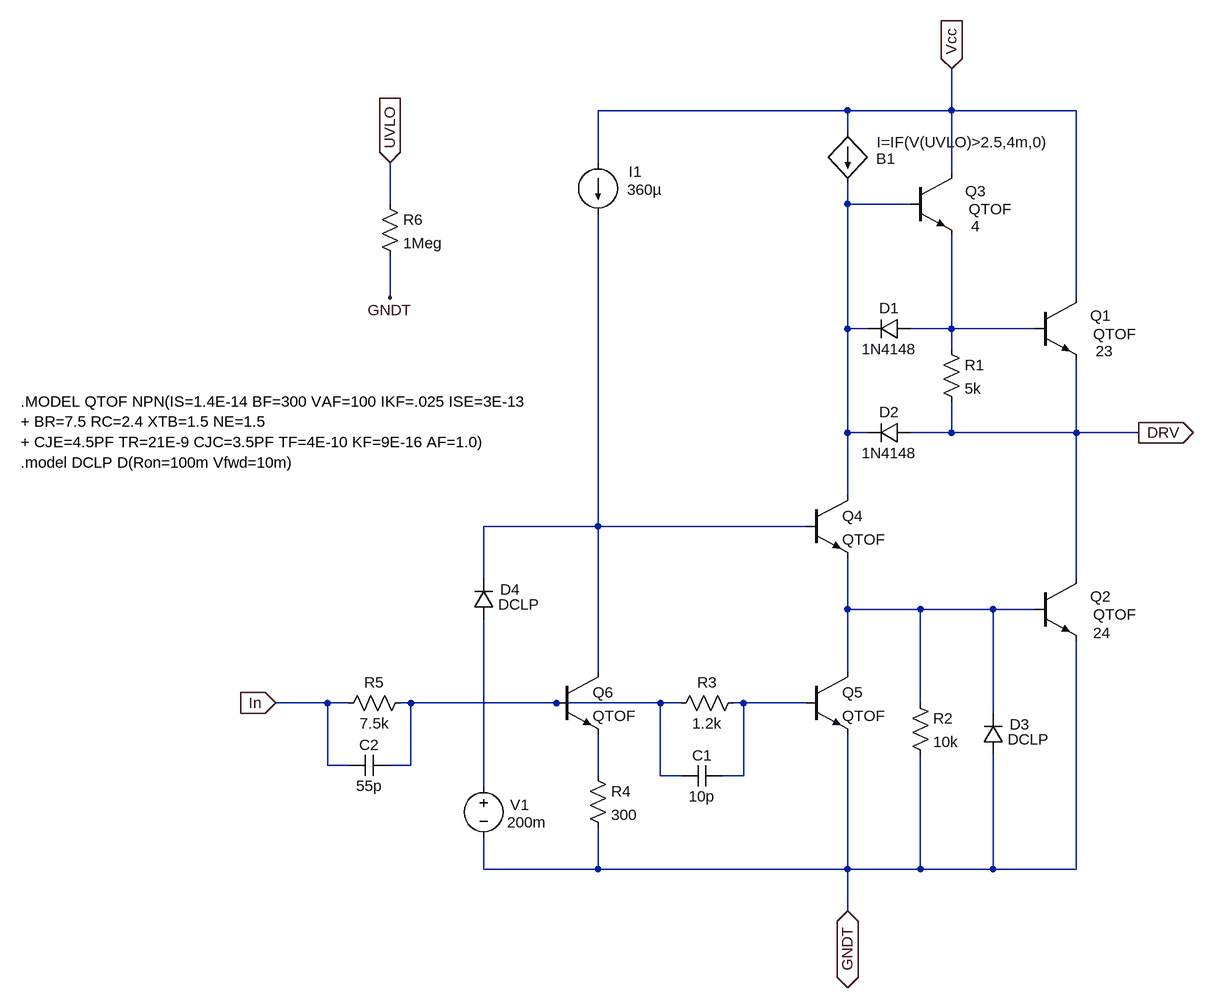
[diagram p0: schematic DRV_384x.asc]
DRV_384x.asc, the LTspice schematic file:
Version 4.1
SHEET 1 1560 1148
WIRE -112 -208 -496 -208
WIRE 48 -208 48 -272
WIRE 48 -208 -112 -208
WIRE 240 -208 48 -208
WIRE -112 -176 -112 -208
WIRE -496 -128 -496 -208
WIRE 48 -112 48 -208
WIRE -816 -64 -816 -128
WIRE -112 -64 -112 -96
WIRE -16 -64 -112 -64
WIRE -816 80 -816 16
WIRE 240 80 240 -208
WIRE -112 128 -112 -64
WIRE -80 128 -112 128
WIRE 48 128 48 -16
WIRE 48 128 -16 128
WIRE 176 128 48 128
WIRE 48 160 48 128
WIRE -112 288 -112 128
WIRE -80 288 -112 288
WIRE 48 288 48 240
WIRE 48 288 -16 288
WIRE 240 288 240 176
WIRE 240 288 48 288
WIRE 336 288 240 288
WIRE -112 384 -112 288
WIRE -496 432 -496 -48
WIRE -496 432 -672 432
WIRE -176 432 -496 432
WIRE -672 512 -672 432
WIRE 240 512 240 288
WIRE -112 560 -112 480
WIRE 0 560 -112 560
WIRE 112 560 0 560
WIRE 176 560 112 560
WIRE -496 656 -496 432
WIRE -112 656 -112 560
WIRE -912 704 -992 704
WIRE -880 704 -912 704
WIRE -784 704 -800 704
WIRE -560 704 -784 704
WIRE -400 704 -560 704
WIRE -368 704 -400 704
WIRE -272 704 -288 704
WIRE -176 704 -272 704
WIRE 0 704 0 560
WIRE 112 720 112 560
WIRE -912 800 -912 704
WIRE -880 800 -912 800
WIRE -784 800 -784 704
WIRE -784 800 -816 800
WIRE -496 816 -496 752
WIRE -400 816 -400 704
WIRE -368 816 -400 816
WIRE -272 816 -272 704
WIRE -272 816 -304 816
WIRE -672 832 -672 576
WIRE -672 960 -672 912
WIRE -496 960 -496 896
WIRE -496 960 -672 960
WIRE -112 960 -112 752
WIRE -112 960 -496 960
WIRE 0 960 0 784
WIRE 0 960 -112 960
WIRE 112 960 112 784
WIRE 112 960 0 960
WIRE 240 960 240 608
WIRE 240 960 112 960
WIRE -112 1024 -112 960
FLAG 336 288 DRV
IOPIN 336 288 Out
FLAG 48 -272 Vcc
IOPIN 48 -272 In
FLAG -992 704 In
IOPIN -992 704 In
FLAG -112 1024 GNDT
IOPIN -112 1024 BiDir
FLAG -816 80 GNDT
FLAG -816 -128 UVLO
IOPIN -816 -128 In
SYMBOL npn 176 80 R0
WINDOW 0 85 28 Left 2
WINDOW 3 90 56 Left 2
WINDOW 39 94 82 Left 2
SYMATTR InstName Q1
SYMATTR Value QTOF
SYMATTR SpiceLine 23
SYMBOL npn 176 512 R0
WINDOW 0 85 28 Left 2
WINDOW 3 90 56 Left 2
WINDOW 39 90 84 Left 2
SYMATTR InstName Q2
SYMATTR Value QTOF
SYMATTR SpiceLine 24
SYMBOL npn -16 -112 R0
WINDOW 0 85 28 Left 2
WINDOW 3 90 56 Left 2
WINDOW 39 94 82 Left 2
SYMATTR InstName Q3
SYMATTR Value QTOF
SYMATTR SpiceLine 4
SYMBOL res 32 144 R0
SYMATTR InstName R1
SYMATTR Value 5k
SYMBOL diode -16 112 R90
WINDOW 0 0 32 VBottom 2
WINDOW 3 32 32 VTop 2
SYMATTR InstName D1
SYMATTR Value 1N4148
SYMBOL diode -16 272 R90
WINDOW 0 0 32 VBottom 2
WINDOW 3 32 32 VTop 2
SYMATTR InstName D2
SYMATTR Value 1N4148
SYMBOL bi -112 -176 R0
WINDOW 0 44 42 Left 2
WINDOW 3 45 17 Left 2
SYMATTR InstName B1
SYMATTR Value I=IF(V(UVLO)>2.5,4m,0)
SYMBOL npn -176 384 R0
SYMATTR InstName Q4
SYMATTR Value QTOF
SYMBOL res -16 688 R0
SYMATTR InstName R2
SYMATTR Value 10k
SYMBOL diode 128 784 R180
WINDOW 0 -40 47 Left 2
WINDOW 3 -70 24 Left 2
SYMATTR InstName D3
SYMATTR Value DCLP
SYMBOL npn -176 656 R0
SYMATTR InstName Q5
SYMATTR Value QTOF
SYMBOL res -272 688 R90
WINDOW 0 0 56 VBottom 2
WINDOW 3 32 56 VTop 2
SYMATTR InstName R3
SYMATTR Value 1.2k
SYMBOL cap -304 800 R90
WINDOW 0 0 32 VBottom 2
WINDOW 3 32 32 VTop 2
SYMATTR InstName C1
SYMATTR Value 10p
SYMBOL npn -560 656 R0
SYMATTR InstName Q6
SYMATTR Value QTOF
SYMBOL res -512 800 R0
SYMATTR InstName R4
SYMATTR Value 300
SYMBOL current -496 -128 R0
WINDOW 0 47 14 Left 2
WINDOW 3 45 42 Left 2
SYMATTR InstName I1
SYMATTR Value 360µ
SYMBOL diode -656 576 R180
WINDOW 0 -40 47 Left 2
WINDOW 3 -70 24 Left 2
SYMATTR InstName D4
SYMATTR Value DCLP
SYMBOL voltage -672 816 R0
WINDOW 0 41 45 Left 2
WINDOW 3 36 72 Left 2
SYMATTR InstName V1
SYMATTR Value 200m
SYMBOL res -784 688 R90
WINDOW 0 0 56 VBottom 2
WINDOW 3 32 56 VTop 2
SYMATTR InstName R5
SYMATTR Value 7.5k
SYMBOL cap -816 784 R90
WINDOW 0 0 32 VBottom 2
WINDOW 3 32 32 VTop 2
SYMATTR InstName C2
SYMATTR Value 55p
SYMBOL res -832 -80 R0
SYMATTR InstName R6
SYMATTR Value 1Meg
TEXT -1384 240 Left 2 !.MODEL QTOF NPN(IS=1.4E-14 BF=300 VAF=100 IKF=.025 ISE=3E-13\n+ BR=7.5 RC=2.4 XTB=1.5 NE=1.5\n+ CJE=4.5PF TR=21E-9 CJC=3.5PF TF=4E-10 KF=9E-16 AF=1.0) \n.model DCLP D(Ron=100m Vfwd=10m)

The netlist it stands for:
* DRV_384x.asc
Q1 Vcc N002 DRV 0 QTOF 23
Q2 DRV N004 GNDT 0 QTOF 24
Q3 Vcc N001 N002 0 QTOF 4
R1 N002 DRV 5k
D1 N002 N001 1N4148
D2 DRV N001 1N4148
B1 Vcc N001 I=IF(V(UVLO)>2.5,4m,0)
Q4 N001 N003 N004 0 QTOF
R2 N004 GNDT 10k
D3 GNDT N004 DCLP
Q5 N004 N006 GNDT 0 QTOF
R3 N006 N005 1.2k
C1 N006 N005 10p
Q6 N003 N005 N007 0 QTOF
R4 N007 GNDT 300
I1 Vcc N003 360µ
D4 N008 N003 DCLP
V1 N008 GNDT 200m
R5 N005 In 7.5k
C2 N005 In 55p
R6 UVLO GNDT 1Meg
.model D D
.lib standard.dio
.model NPN NPN
.model PNP PNP
.lib standard.bjt
.MODEL QTOF NPN(IS=1.4E-14 BF=300 VAF=100 IKF=.025 ISE=3E-13
+ BR=7.5 RC=2.4 XTB=1.5 NE=1.5
+ CJE=4.5PF TR=21E-9 CJC=3.5PF TF=4E-10 KF=9E-16 AF=1.0)
.model DCLP D(Ron=100m Vfwd=10m)
.backanno
.end